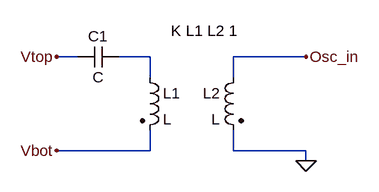
[diagram p0: schematic Draft1.asc]
Draft1.asc, the LTspice schematic file:
Version 4
SHEET 1 880 680
WIRE 16 80 -16 80
WIRE 128 80 80 80
WIRE 368 80 256 80
WIRE 128 112 128 80
WIRE 256 112 256 80
WIRE 128 224 128 192
WIRE 128 224 -16 224
WIRE 256 224 256 192
WIRE 368 224 256 224
WIRE 368 240 368 224
FLAG -16 80 Vtop
FLAG -16 224 Vbot
FLAG 368 80 Osc_in
FLAG 368 240 0
SYMBOL ind2 112 96 R0
SYMATTR InstName L1
SYMATTR Type ind
SYMBOL ind2 272 96 M0
SYMATTR InstName L2
SYMATTR Type ind
SYMBOL cap 80 64 R90
WINDOW 0 0 32 VBottom 2
WINDOW 3 32 32 VTop 2
SYMATTR InstName C1
TEXT 160 40 Left 2 !K L1 L2 1

The netlist it stands for:
* Draft1.asc
L1 N001 Vbot L
L2 Osc_in 0 L
C1 N001 Vtop C
K L1 L2 1
.backanno
.end